# EAGLE design GoL 1.3 (EAGLE 4.13)
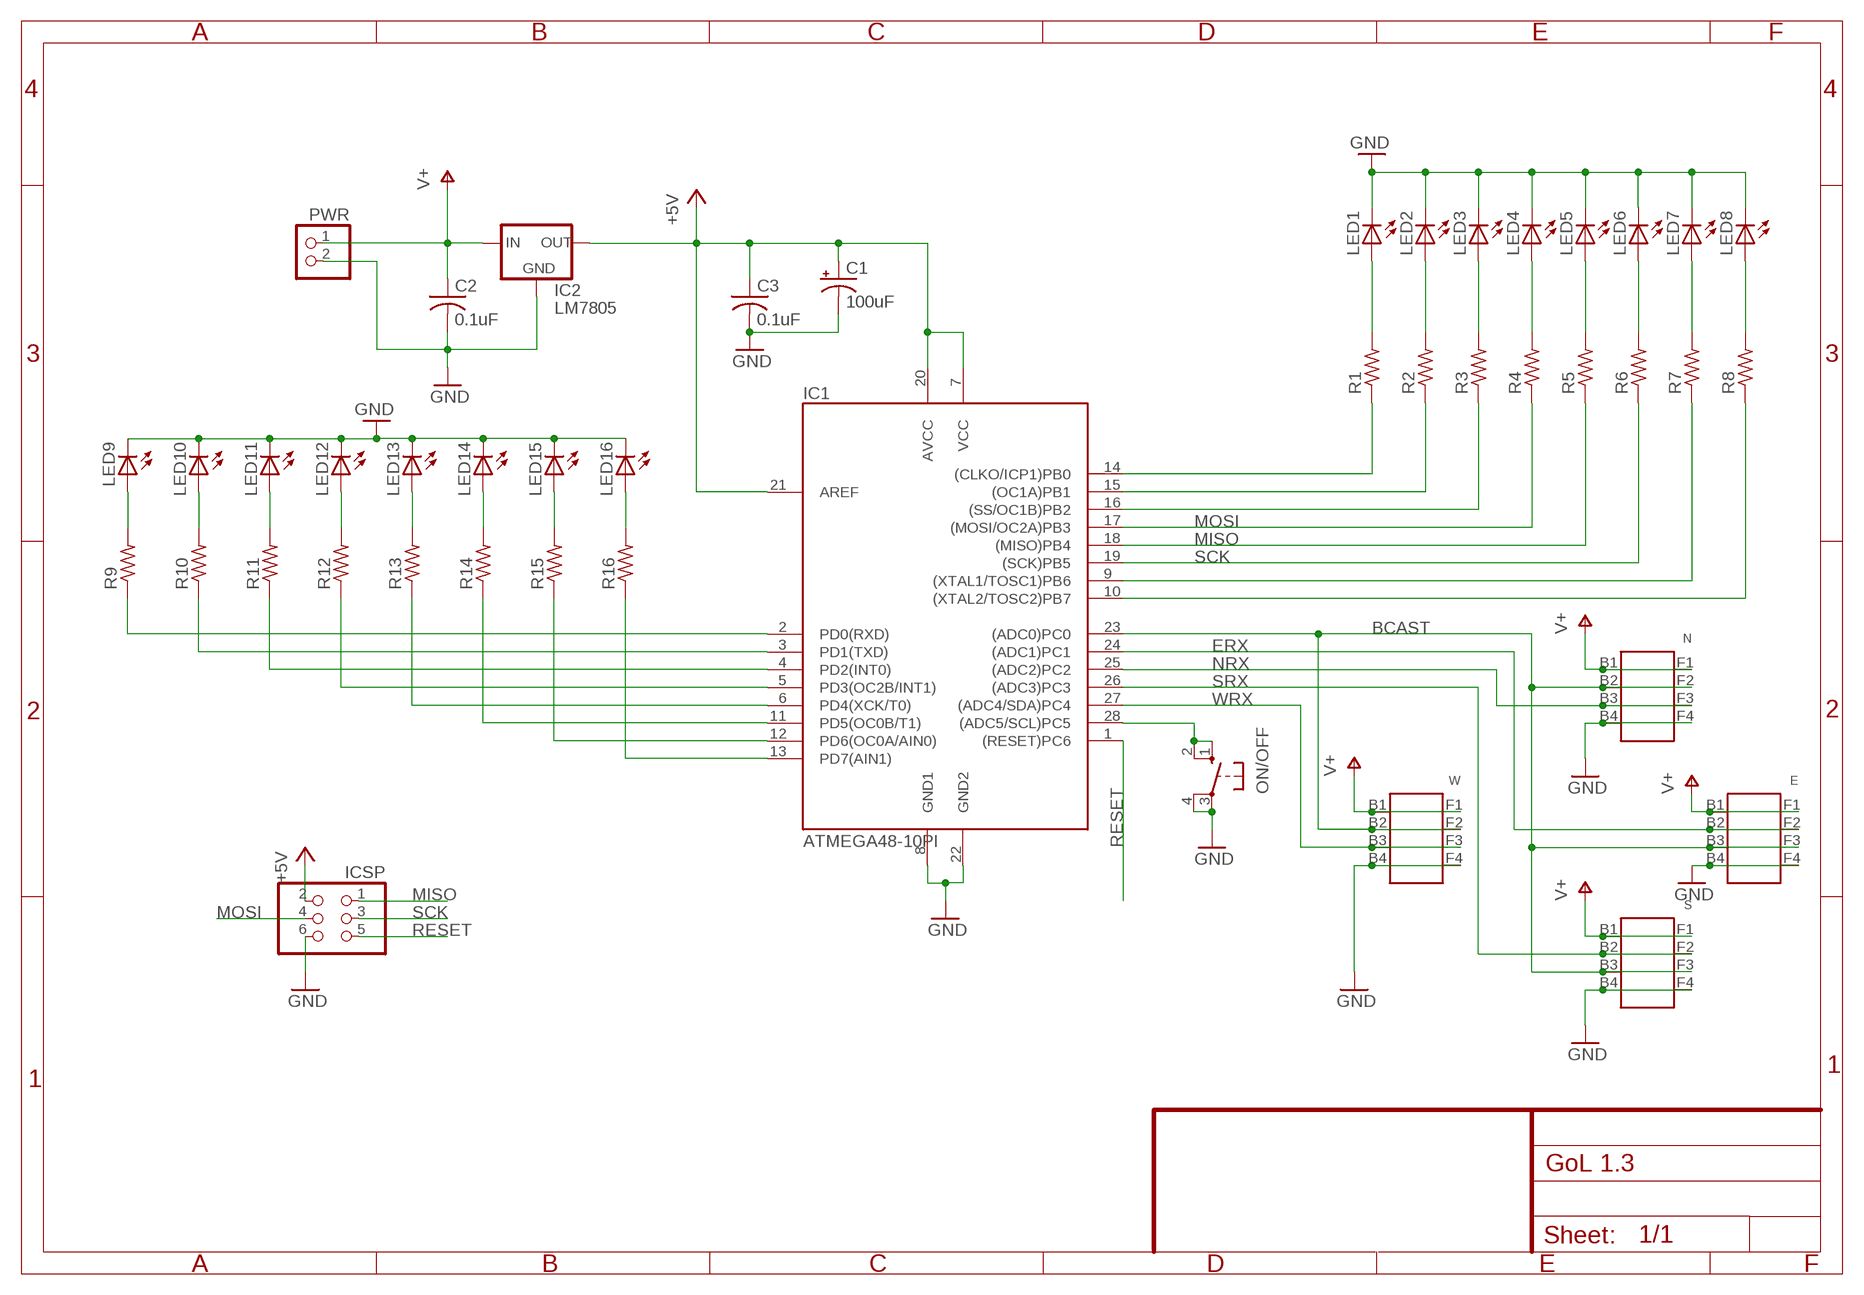
[diagram p0: schematic, sheet 1]

## Parts
C1  100uF  CPOL-USE2.5-6  [E2,5-6]
C2  0.1uF  C-US025-025X050  [C025-025X050]
C3  0.1uF  C-US025-025X050  [C025-025X050]
E  CONNECT4  [CON4-0.15]
IC1  ATMEGA48-10PI  [DIL28-3]
IC2  LM7805  [TO220]
ICSP  PINHD-2X3  [2X03]
LED1  LED5MMEZ  [LED5MM-EZ]
LED2  LED5MMEZ  [LED5MM-EZ]
LED3  LED5MMEZ  [LED5MM-EZ]
LED4  LED5MMEZ  [LED5MM-EZ]
LED5  LED5MMEZ  [LED5MM-EZ]
LED6  LED5MMEZ  [LED5MM-EZ]
LED7  LED5MMEZ  [LED5MM-EZ]
LED8  LED5MMEZ  [LED5MM-EZ]
LED9  LED5MMEZ  [LED5MM-EZ]
LED10  LED5MMEZ  [LED5MM-EZ]
LED11  LED5MMEZ  [LED5MM-EZ]
LED12  LED5MMEZ  [LED5MM-EZ]
LED13  LED5MMEZ  [LED5MM-EZ]
LED14  LED5MMEZ  [LED5MM-EZ]
LED15  LED5MMEZ  [LED5MM-EZ]
LED16  LED5MMEZ  [LED5MM-EZ]
N  CONNECT4  [CON4-0.15]
ON/OFF  10-XX  [B3F-10XX]
PWR  PINHD-1X2  [1X02]
R1  R-US_0207/10  [0207/10]
R2  R-US_0207/10  [0207/10]
R3  R-US_0207/10  [0207/10]
R4  R-US_0207/10  [0207/10]
R5  R-US_0207/10  [0207/10]
R6  R-US_0207/10  [0207/10]
R7  R-US_0207/10  [0207/10]
R8  R-US_0207/10  [0207/10]
R9  R-US_0207/10  [0207/10]
R10  R-US_0207/10  [0207/10]
R11  R-US_0207/10  [0207/10]
R12  R-US_0207/10  [0207/10]
R13  R-US_0207/10  [0207/10]
R14  R-US_0207/10  [0207/10]
R15  R-US_0207/10  [0207/10]
R16  R-US_0207/10  [0207/10]
S  CONNECT4  [CON4-0.15]
W  CONNECT4  [CON4-0.15]

## Nets
+5V [power]: C1.+ C3.1 IC1.7(VCC) IC1.20(AVCC) IC1.21(AREF) IC2.3(OUT) ICSP.2
BCAST: E.B3 E.F3 IC1.23((ADC0)PC0) N.B2 N.F2 S.B3 S.F3 W.B2 W.F2
ERX: E.B2 E.F2 IC1.24((ADC1)PC1)
GND [power]: C1.- C2.2 C3.2 E.B4 E.F4 IC1.8(GND1) IC1.22(GND2) IC2.2(GND) ICSP.6 LED1.K(C) LED2.K(C) LED3.K(C) LED4.K(C) LED5.K(C) LED6.K(C) LED7.K(C) LED8.K(C) LED9.K(C) LED10.K(C) LED11.K(C) LED12.K(C) LED13.K(C) LED14.K(C) LED15.K(C) LED16.K(C) N.B4 N.F4 ON/OFF.3(P) ON/OFF.4(P1) PWR.2 S.B4 S.F4 W.B4 W.F4
MISO: IC1.18((MISO)PB4) ICSP.1 R5.1
MOSI: IC1.17((MOSI/OC2A)PB3) ICSP.4 R4.1
N$1: LED1.A R1.2
N$2: LED2.A R2.2
N$3: LED3.A R3.2
N$4: LED4.A R4.2
N$5: LED5.A R5.2
N$6: LED6.A R6.2
N$7: LED7.A R7.2
N$8: LED8.A R8.2
N$9: LED9.A R9.2
N$10: LED10.A R10.2
N$11: LED11.A R11.2
N$12: LED12.A R12.2
N$13: LED13.A R13.2
N$14: LED14.A R14.2
N$15: LED15.A R15.2
N$16: LED16.A R16.2
N$17: IC1.13(PD7(AIN1)) R16.1
N$18: IC1.12(PD6(OC0A/AIN0)) R15.1
N$19: IC1.11(PD5(OC0B/T1)) R14.1
N$20: IC1.6(PD4(XCK/T0)) R13.1
N$21: IC1.5(PD3(OC2B/INT1)) R12.1
N$22: IC1.4(PD2(INT0)) R11.1
N$23: IC1.3(PD1(TXD)) R10.1
N$24: IC1.2(PD0(RXD)) R9.1
N$25: IC1.28((ADC5/SCL)PC5) ON/OFF.1(S) ON/OFF.2(S1)
N$26: IC1.14((CLKO/ICP1)PB0) R1.1
N$27: IC1.15((OC1A)PB1) R2.1
N$28: IC1.16((SS/OC1B)PB2) R3.1
N$32: IC1.9((XTAL1/TOSC1)PB6) R7.1
N$33: IC1.10((XTAL2/TOSC2)PB7) R8.1
NRX: IC1.25((ADC2)PC2) N.B3 N.F3
RESET: IC1.1((RESET)PC6) ICSP.5
SCK: IC1.19((SCK)PB5) ICSP.3 R6.1
SRX: IC1.26((ADC3)PC3) S.B2 S.F2
V+ [power]: C2.1 E.B1 E.F1 IC2.1(IN) N.B1 N.F1 PWR.1 S.B1 S.F1 W.B1 W.F1
WRX: IC1.27((ADC4/SDA)PC4) W.B3 W.F3

## Library data of the parts
C1 = rcl-ez:CPOL-US: POLARIZED CAPACITOR, American symbol
C2 C3 = rcl-ez:C-US: CAPACITOR, American symbol
E N S W = lifeofrush:CONNECT4
IC1 = atmel-2005:ATMEGA*PI: MICROCONTROLLER 8KB Flash 10-bit ADC Six PWM Channels
IC2 = lifeofrush:LM7805: LM7805 5V Linear Regulator
ICSP = pinhead:PINHD-2X3: PIN HEADER
LED1-LED16 = led:LED: LED OSRAM: - CHIPLED LG R971, LG N971, LY N971, LG Q971, LY Q971, LO R971, LY R971 LH N974, LH R974 LS Q976, LO Q976, LY Q976 LO Q996 - Hyper CHIPLED LW Q18S LB Q993, LB Q99A, LB R99A - SideLED LS A670, LO A670, LY A670, LG A670, LP A670 LB A673, LV A673, LT A673, LW A673 LH A674 LY A675 LS A676, LA A676, LO A676, LY A676, LW A676 LS A679, LY A679, LG A679 - Hyper Micro SIDELED® LS Y876, LA Y876, LO Y876, LY Y876 LT Y87S - SmartLED LW L88C, LW L88S LB L89C, LB L89S, LG L890 LS L89K, LO L89K, LY L89K LS L896, LA L896, LO L896, LY L896 - TOPLED LS T670, LO T670, LY T670, LG T670, LP T670 LSG T670, LSP T670, LSY T670, LOP T670, LYG T670 LG T671, LOG T671, LSG T671 LB T673, LV T673, LT T673, LW T673 LH T674 LS T676, LA T676, LO T676, LY T676, LB T676, LH T676, LSB T676, LW T676 LB T67C, LV T67C, LT T67C, LS T67K, LO T67K, LY T67K, LW E67C LS E67B, LA E67B, LO E67B, LY E67B, LB E67C, LV E67C, LT E67C LW T67C LS T679, LY T679, LG T679 LS T770, LO T770, LY T770, LG T770, LP T770 LB T773, LV T773, LT T773, LW T773 LH T774 LS E675, LA E675, LY E675, LS T675 LS T776, LA T776, LO T776, LY T776, LB T776 LHGB T686 LT T68C, LB T68C - Hyper Mini TOPLED® LB M676 - Mini TOPLED Santana® LG M470 LS M47K, LO M47K, LY M47K Source: http://www.osram.convergy.de/
ON/OFF = switch-omron:10-XX: OMRON SWITCH
PWR = pinhead:PINHD-1X2: PIN HEADER
R1-R16 = rcl-ez:R-US_: RESISTOR, American symbol

## Net classes
1 power: width 1.27 mm, drill 0.406 mm, clearance 0.711 mm

## Board
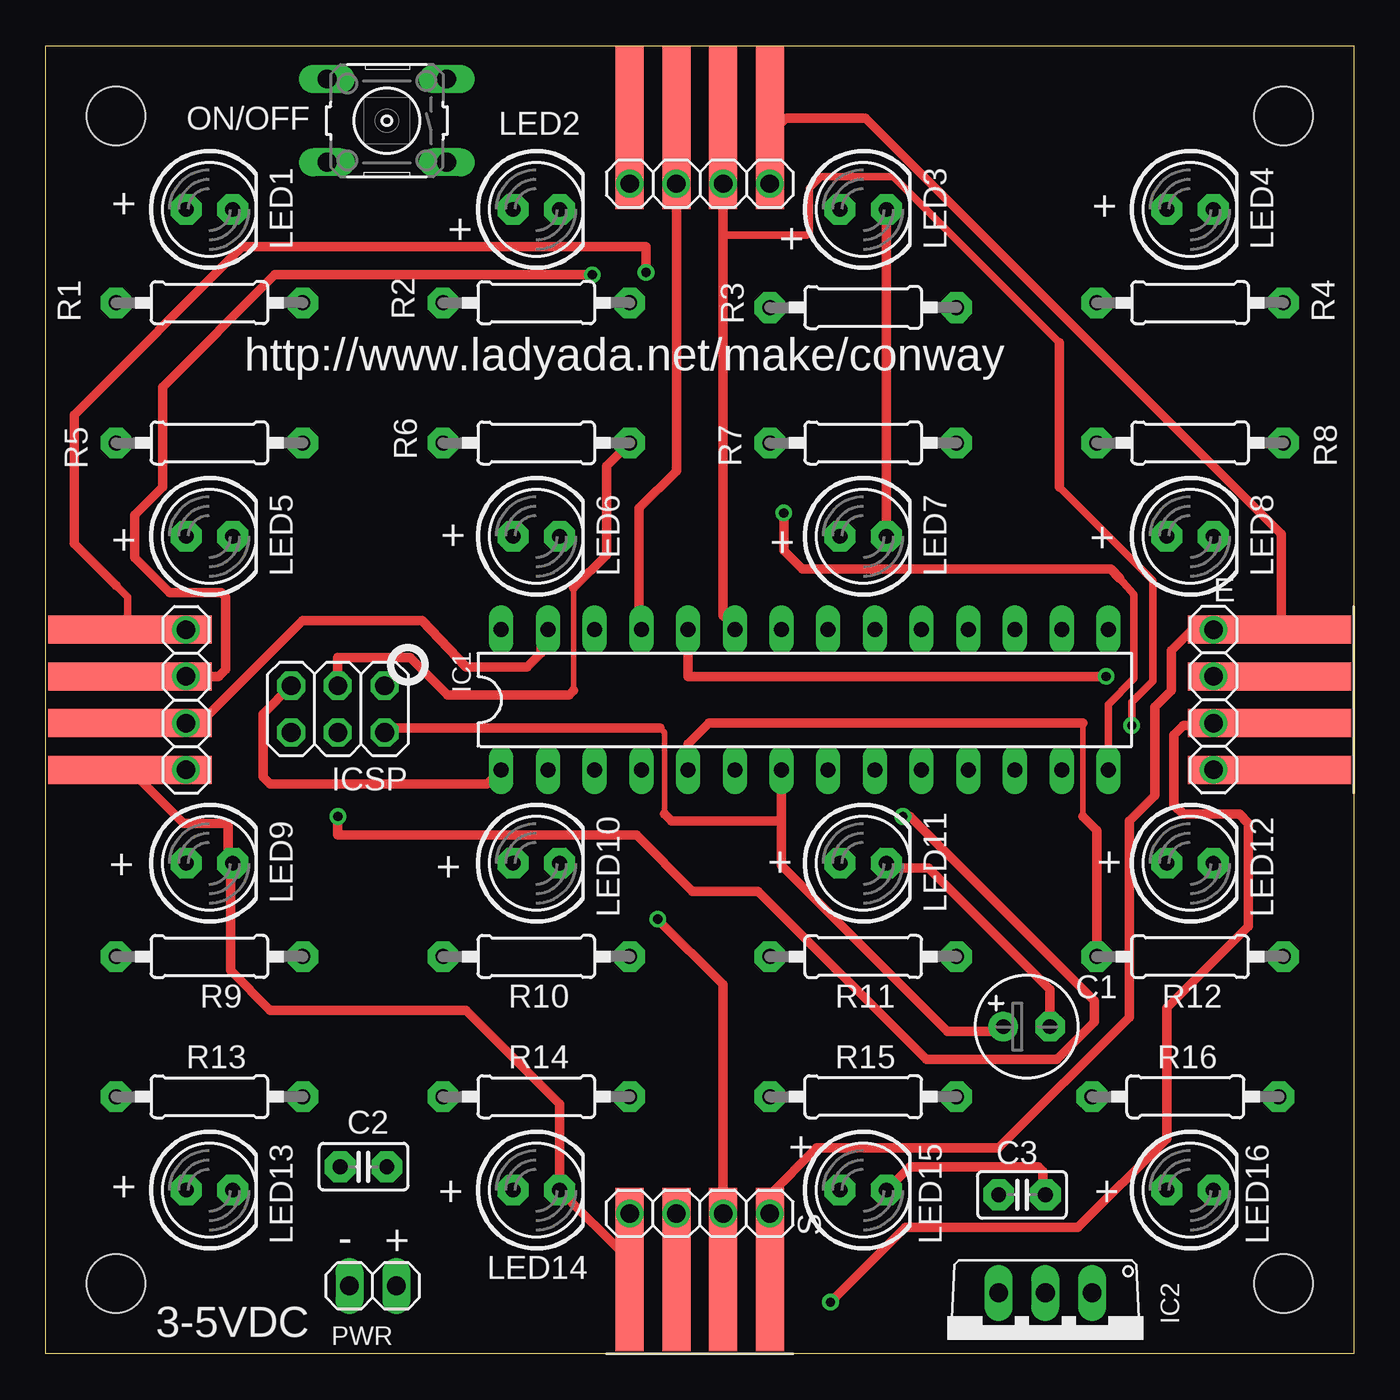
[diagram p1: board, top side]
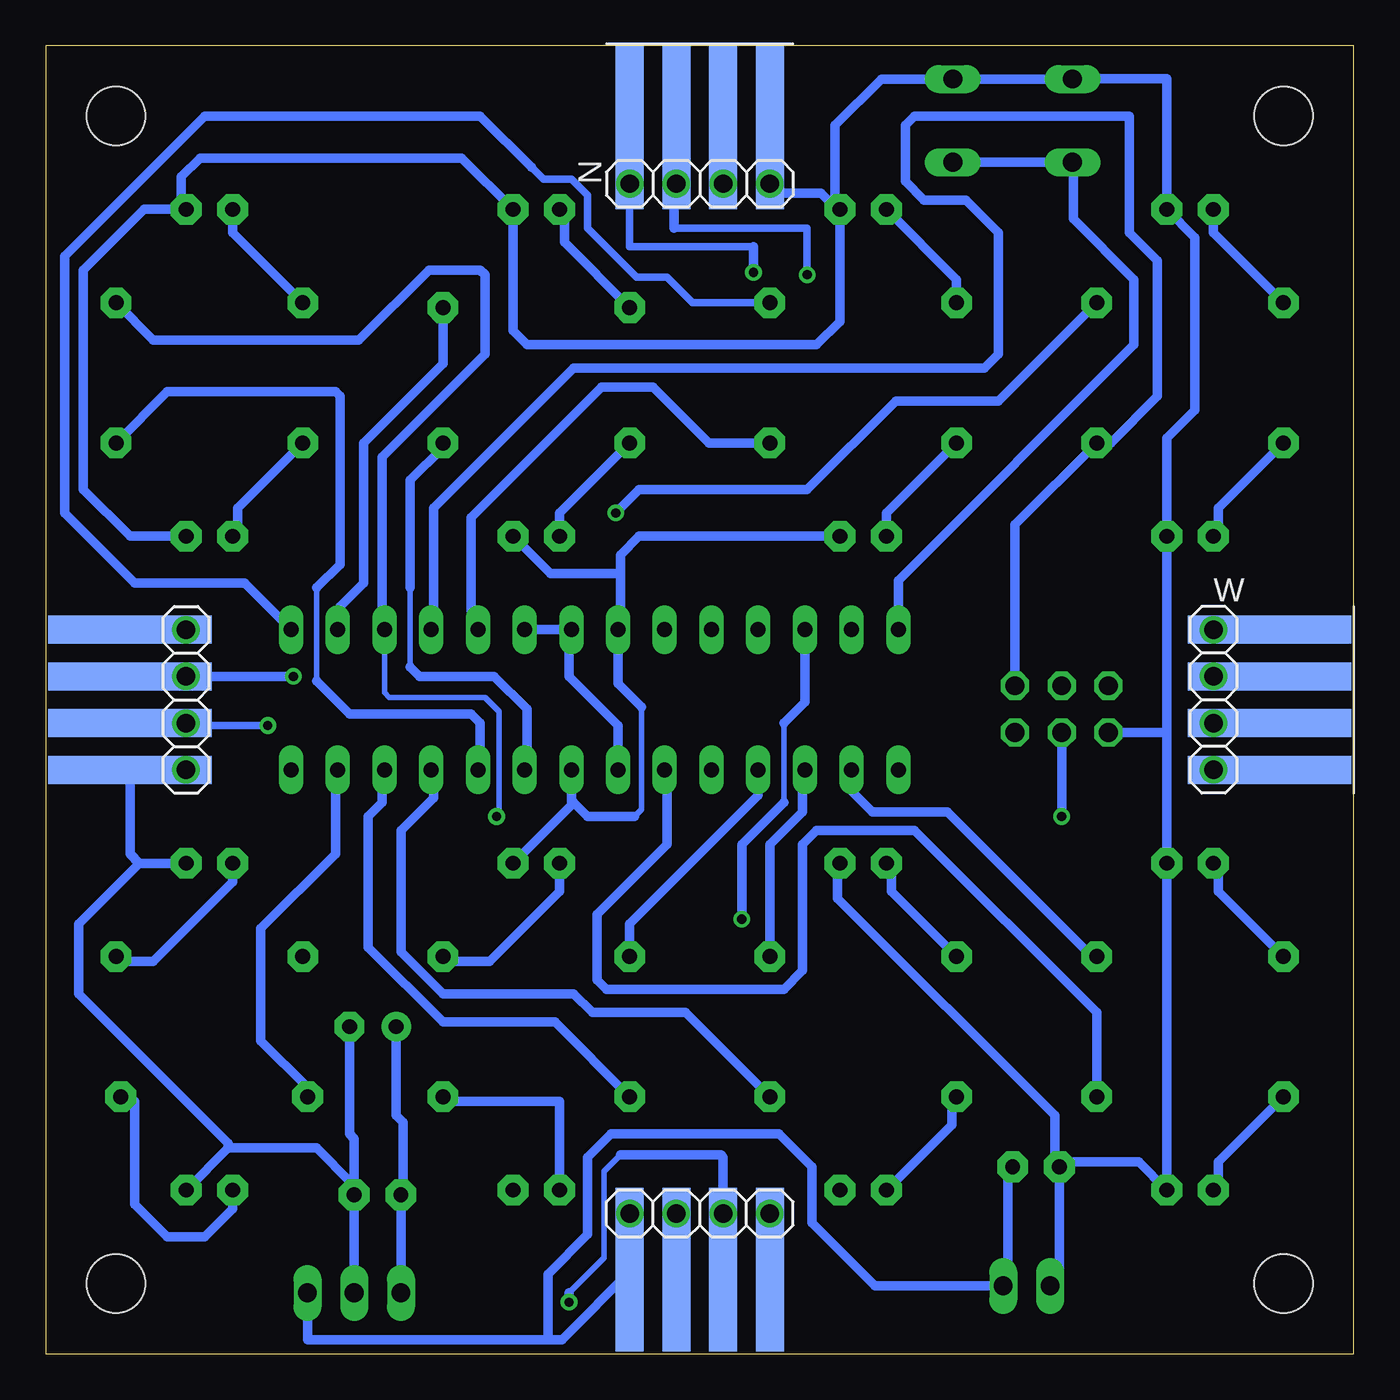
[diagram p2: board, bottom side, seen from below]

Size 71.12 x 71.12 mm. Coordinates in mm from the lower left corner, seen from the top.
Outline: 0,0 0,71.12 71.12,71.12 71.12,0 0,0
Copper layers (1*16): Top 0.035mm / dielectric 1.5mm / Bottom 0.035mm
Design rules "default": minimum track width 2mil, minimum drill 19mil, track to track 12mil, track to pad 12mil, pad to pad 12mil, via to via 12mil, smd to smd 0mil, copper to edge 0mil, drill to drill 8mil, minimum pad ring 10mil, minimum via ring 8mil, stop-mask expansion 4mil, vias tented up to drill 0mil, thermal gap 10mil
Holes 3.2 mm at 3.81,67.31 67.31,67.31 67.31,3.81 3.81,3.81

### Footprints (pad centres in the part's own frame; a part is rotated, then mirrored left to right if it is on the bottom)
E2,5-6 = drill 0.813 pad 1.6 round: + -1.27,0 | drill 0.813 pad 1.6 octagon: - 1.27,0
C025-025X050 = drill 0.813 pad 1.676 octagon: 1 -1.27,0; 2 1.27,0
CON4-0.15 = smd 1.524 x 8.89 bottom: B1 -3.81,3.048; B2 -1.27,3.048; B3 1.27,3.048; B4 3.81,3.048 | smd 1.524 x 8.89: F1 -3.81,3.048; F2 -1.27,3.048; F3 1.27,3.048; F4 3.81,3.048
DIL28-3 = drill 0.813 long: 1 -16.51,-3.81; 2 -13.97,-3.81; 3 -11.43,-3.81; 4 -8.89,-3.81; 5 -6.35,-3.81; 6 -3.81,-3.81; 7 -1.27,-3.81; 8 1.27,-3.81; 9 3.81,-3.81; 10 6.35,-3.81; 11 8.89,-3.81; 12 11.43,-3.81; 13 13.97,-3.81; 14 16.51,-3.81; 15 16.51,3.81; 16 13.97,3.81; 17 11.43,3.81; 18 8.89,3.81; 19 6.35,3.81; 20 3.81,3.81; 21 1.27,3.81; 22 -1.27,3.81; 23 -3.81,3.81; 24 -6.35,3.81; 25 -8.89,3.81; 26 -11.43,3.81; 27 -13.97,3.81; 28 -16.51,3.81
TO220@1 = drill 1.016 long: 1 -2.54,-2.54; 2 0,-2.54; 3 2.54,-2.54
2X03 = drill 1.016 octagon: 1 -2.54,-1.27; 2 -2.54,1.27; 3 0,-1.27; 4 0,1.27; 5 2.54,-1.27; 6 2.54,1.27
LED5MM-EZ = drill 0.813 pad 1.676 octagon: A -1.27,0; K 1.27,0
B3F-10XX = drill 1.016 long: 1 -3.251,2.261; 2 3.251,2.261; 3 -3.251,-2.261; 4 3.251,-2.261
1X02 = drill 1.016 long: 1 -1.27,0; 2 1.27,0
0207/10 = drill 0.813 pad 1.676 octagon: 1 -5.08,0; 2 5.08,0

### Placement (x,y rotation side)
C1  53.34,17.78 0 top
C2  17.27,10.16 180 top
C3  53.09,8.64 0 top
E  63.5,35.56 270 top
IC1  41.27,35.56 0 top
IC2  LM7805  [TO220@1]  54.36,0.76 180 top
ICSP  15.88,35.05 180 top
LED1  8.89,62.23 0 top
LED2  26.67,62.23 0 top
LED3  44.45,62.23 0 top
LED4  62.23,62.23 0 top
LED5  8.89,44.45 0 top
LED6  26.67,44.45 0 top
LED7  44.45,44.45 0 top
LED8  62.23,44.45 0 top
LED9  8.89,26.67 0 top
LED10  26.67,26.67 0 top
LED11  44.45,26.67 0 top
LED12  62.23,26.67 0 top
LED13  8.89,8.89 0 top
LED14  26.67,8.89 0 top
LED15  44.45,8.89 0 top
LED16  62.23,8.89 0 top
N  35.56,63.63 0 bottom
ON/OFF  18.54,67.06 180 top
PWR  17.78,3.68 180 top
R1  8.89,57.15 180 top
R2  26.67,57.15 180 top
R3  44.45,56.9 180 top
R4  62.23,57.15 180 top
R5  8.89,49.53 180 top
R6  26.67,49.53 180 top
R7  44.45,49.53 180 top
R8  62.23,49.53 180 top
R9  8.89,21.59 180 top
R10  26.67,21.59 180 top
R11  44.45,21.59 0 top
R12  62.23,21.59 0 top
R13  8.89,13.97 180 top
R14  26.67,13.97 180 top
R15  44.45,13.97 0 top
R16  61.98,13.97 0 top
S  35.56,7.62 180 top
W  7.62,35.56 270 bottom

### Tracks (layer width: path | path; a pad name or v marks a point on that pad's centre or on a via)
+5V
  Top 0.305: 33.4,34.04 33.66,33.78 33.66,29.34
  Top 0.508: 40.01,28.96 40.01,26.54 49.02,17.53 51.82,17.53 C1.+ | 40.01,28.96 IC1.7 | ICSP.2 18.67,34.04 33.4,34.04 | 33.66,29.34 34.04,28.96 40.01,28.96
  Bottom 0.508: IC1.20 45.09,39.5 44.96,39.62 44.7,39.37 42.67,39.37 | C3.1 51.82,8.89 | C3.1 IC2.3 | IC1.7 40.01,34.16 42.67,36.83 42.67,39.37 | 42.67,39.37 IC1.21 | C1.+ 52.07,12.95 51.69,12.57 51.69,8.64 C3.1
BCAST  (via drill 0.5, 1)
  Top 0.406: 55.12,47.12 60.2,42.04 60.2,36.58 59.05,35.43 v59.05,34.16 | 55.12,54.99 46.1,64.01 42.16,64.01 41.53,63.37 41.53,60.96 41.4,60.83 36.83,60.83
  Top 0.508: IC1.23 37.59,39.5 | v29.72,58.67 12.45,58.67 6.35,52.58 6.35,47.12 4.83,45.59 4.83,43.31 6.73,41.4 9.53,41.4 9.78,41.15 9.78,37.21 9.4,36.83 v7.62,36.83 | IC1.23 37.59,39.37 | v42.67,2.79 46.74,6.86 56.13,6.86 60.96,11.68 60.96,18.8 65.41,23.24 65.41,28.83 64.9,29.34 61.85,29.34 61.34,29.84 61.34,33.66 61.85,34.16 66.67,34.16 E.B3 v63.5,34.29 | IC1.23 37.47,39.5 36.83,40.13 36.83,60.83 N.B2 | N.B2 36.83,67.06 | 55.12,47.12 55.12,54.99 | W.B2 4.45,36.83 | v7.62,36.83 W.B2 | W.B2 4.57,36.96 | 4.57,36.96 6.6,36.96 | 4.57,36.96 2.03,36.96 v7.62,36.83 | N.B2 v36.83,63.63 36.83,62.87 | v34.29,7.62 S.B3
  Bottom 0.305: 42.67,3.3 40.77,5.21 40.77,9.91 39.88,10.79
  Bottom 0.406: E.B3 66.42,34.16 v59.05,34.16 | v29.72,58.67 29.72,61.21 36.96,61.21 36.96,66.04 36.83,66.04
  Bottom 0.508: 42.67,3.3 v42.67,2.79 | 39.88,10.79 34.42,10.79 34.29,10.67 S.B3 v34.29,7.62 34.29,9.14 | N.B2 v36.83,63.63 36.7,63.63 36.96,63.37 36.96,61.21 | E.B3 66.55,34.16 65.15,34.29 v63.5,34.29 | v7.62,36.83 W.B2 3.3,36.96 v7.62,36.83
ERX  (via drill 0.5, 1)
  Top 0.508: IC1.24 34.92,36.83 v57.66,36.83 | v63.5,36.83 E.B2
  Bottom 0.508: v57.66,36.83 E.B2 65.28,36.7 v63.5,36.83
GND  (via drill 1)
  Top 0.508: C1.- 54.61,19.81 48.01,26.42 45.97,26.42 LED11.K | LED3.K LED7.K | LED14.K 27.69,8.64 | LED14.K 27.94,13.59 22.86,18.67 12.19,18.67 10.03,20.83 10.03,26.54 LED9.K 10.16,26.92 9.91,27.18 9.91,28.7 9.78,28.83 7.49,28.83 W.B4 v7.62,31.75 7.87,31.62 | LED14.K 31.62,5.21 31.62,4.45 S.B4 v31.75,7.62 | v31.75,63.63 N.B4 | E.B4 66.42,31.75 66.29,31.88 65.15,31.75 v63.5,31.75 | LED15.K 46.99,10.16 53.98,10.16 54.23,9.91 54.23,8.76 C3.2
  Bottom 0.305: 38.73,35.18 38.73,29.59 39.12,29.21
  Bottom 0.406: C2.2 15.75,10.16 16,9.91 16,9.65
  Bottom 0.508: LED8.K 66.55,44.45 69.09,46.99 69.09,58.93 65.79,62.23 LED4.K 63.75,62.23 63.75,64.01 62.74,65.02 48.51,65.02 LED3.K 45.72,55.63 44.96,54.86 29.21,54.86 27.94,56.13 LED2.K | 61.21,11.18 LED16.K | 61.21,11.18 56.39,11.18 54.48,9.27 | C1.- 54.61,11.94 54.36,11.68 54.36,9.4 54.48,9.27 | LED14.K 27.94,9.14 | 64.52,26.67 LED12.K 66.04,26.67 | 66.04,26.67 69.34,23.37 69.34,19.56 61.21,11.43 61.21,11.18 | LED6.K 38.86,44.45 39.88,43.43 39.88,42.42 | 39.88,42.42 39.88,39.5 IC1.22 40.01,36.45 38.73,35.18 | LED7.K 43.69,42.42 39.88,42.42 | ON/OFF.3 ON/OFF.4 15.47,69.32 15.49,69.34 10.16,69.34 LED1.K 8.64,60.71 8.64,51.31 10.16,49.78 LED5.K | ON/OFF.3 21.82,69.32 21.84,69.34 | ON/OFF.3 25.68,69.32 28.19,66.8 28.19,62.48 LED2.K | LED5.K 9.91,44.45 | 10.16,33.78 10.16,27.43 10.41,27.18 10.41,26.92 LED9.K LED13.K 11.68,10.41 16.26,10.41 | 10.16,33.78 LED5.K | 10.16,33.78 ICSP.6 | IC2.2 54.61,3.56 54.36,3.81 C3.2 54.36,9.14 54.48,9.27 | 16.26,10.16 16.26,9.91 C2.2 16.26,10.16 | 16.26,10.41 16.26,12.95 28.07,24.77 28.07,26.54 LED10.K | 16,9.65 16,3.56 16.26,3.81 16.38,3.81 PWR.2 | 16.26,10.41 16.26,10.16 | 42.55,29.97 42.55,29.84 LED11.K | 42.55,29.97 IC1.8 | 42.55,29.97 42.42,29.97 41.66,29.21 39.12,29.21 | 66.04,26.67 66.55,27.18 E.B4 v63.5,31.75 | v7.62,31.75 4.7,31.88 W.B4 | v31.75,63.63 N.B4 v31.75,63.63 | v31.75,63.63 31.24,63.12 28.96,63.12 28.07,62.23 LED2.K | v31.75,7.62 S.B4
MISO
  Bottom 0.508: ICSP.1 18.41,45.09 R5.1 13.21,49.53 10.67,52.07 10.67,59.44 12.19,60.96 12.19,67.31 23.88,67.31 24.38,66.8 24.38,63.75 23.37,62.74 21.08,62.74 19.3,60.96 19.3,54.36 20.07,53.59 42.42,53.59 50.04,45.97 50.04,39.5 IC1.18
MOSI  (via drill 0.5)
  Top 0.508: v15.88,29.21 15.88,28.19 32.13,28.19 35.18,25.15 38.73,25.15 47.88,16 54.99,16 57.02,18.03 57.02,19.18 46.99,29.21 v46.61,29.21
  Bottom 0.305: v46.61,29.21 46.48,29.34 46.48,34.92 47.24,35.69 52.45,35.69 52.7,35.94 IC1.17 52.7,39.75
  Bottom 0.508: R4.1 65.28,55.12 54.1,55.12 50.29,58.93 47.5,58.93 47.24,58.67 47.24,54.36 52.83,48.77 52.83,39.5 IC1.17 | v15.88,29.21 ICSP.4
N$1
  Bottom 0.508: 7.62,62.48 LED1.A 7.62,60.96 R1.2
N$2
  Bottom 0.508: LED2.A 21.59,58.42 R2.2
N$3
  Bottom 0.508: LED3.A 42.93,62.23 42.93,60.45 R3.2
N$4
  Bottom 0.508: R4.2 60.96,60.96 LED4.A
N$5
  Bottom 0.508: R5.2 7.37,45.97 7.37,44.45 LED5.A
N$6
  Bottom 0.508: R6.2 25.4,45.72 LED6.A
N$7
  Bottom 0.508: R7.2 43.18,45.72 LED7.A
N$8
  Bottom 0.508: LED8.A 60.71,44.45 60.71,45.97 R8.2
N$9
  Bottom 0.508: LED9.A 7.37,26.42 7.37,25.15 R9.2
N$10
  Bottom 0.508: LED10.A 25.15,26.67 25.15,25.15 R10.2
N$11
  Bottom 0.508: LED11.A 43.18,25.15 46.99,21.34 49.28,21.34 R11.2
N$12
  Bottom 0.508: LED12.A 60.96,25.65 65.28,21.34 66.8,21.34 67.31,21.84 R12.2
N$13
  Bottom 0.508: R13.2 7.37,10.41 7.37,9.14 LED13.A
N$14
  Bottom 0.508: R14.2 21.84,13.97 21.84,12.45 LED14.A
N$15
  Bottom 0.508: R15.2 49.53,13.72 43.18,13.72 LED15.A
N$16
  Bottom 0.508: LED16.A 60.96,7.87 62.48,6.35 64.52,6.35 66.29,8.13 66.29,13.72 66.8,14.22 R16.2
N$17
  Bottom 0.508: R16.1 56.9,14.48 59.44,17.02 59.44,23.11 55.37,27.18 55.37,30.99 55.12,31.24 55.12,31.75 IC1.13
N$18
  Bottom 0.508: R15.1 43.43,18.03 49.53,18.03 53.59,22.1 53.59,29.21 52.83,29.97 52.83,31.75 IC1.12
N$19
  Bottom 0.508: R14.1 36.32,18.54 41.4,18.54 42.42,19.56 49.53,19.56 51.82,21.84 51.82,28.45 50.04,30.23 50.04,31.75 IC1.11
N$20
  Bottom 0.508: R13.1 13.97,18.54 23.88,28.45 29.21,28.45 29.97,27.69 29.97,20.83 30.99,19.81 40.64,19.81 41.15,20.32 41.15,23.88 37.34,27.69 37.34,32 37.47,31.88 IC1.6
N$21
  Top 0.305: 56.39,34.29 56.39,29.21
  Top 0.508: IC1.5 34.92,33.15 36.07,34.29 56.39,34.29 | 56.39,29.21 57.15,28.45 R12.1
N$22
  Bottom 0.508: IC1.4 32.38,30.35 39.37,23.37 R11.1
N$23
  Bottom 0.508: R10.1 31.75,27.69 29.97,29.46 29.97,31.75 IC1.3
N$24
  Bottom 0.508: R9.1 14.22,21.59 22.1,29.46 26.16,29.46 27.43,30.73 27.43,31.5 27.18,31.75 IC1.2
N$25
  Bottom 0.508: 21.82,64.8 ON/OFF.1 | ON/OFF.2 21.82,64.8 | 21.82,64.8 21.84,64.77 | IC1.28 24.77,42.04 11.94,54.86 11.94,58.42 15.24,61.72 15.24,64.77 | 15.24,64.77 15.27,64.8 ON/OFF.2 | 15.24,64.77 15.27,64.77 ON/OFF.2
N$26  (via drill 0.5)
  Top 0.406: IC1.14 57.91,31.75 57.78,31.88 57.78,35.31 59.18,36.7 59.18,41.27 58.42,42.16
  Top 0.508: v40.13,45.72 40.13,43.69 41.15,42.67 57.91,42.67 58.42,42.16
  Bottom 0.508: R1.1 19.3,51.82 24.89,51.82 29.72,46.99 38.86,46.99 v40.13,45.72
N$27
  Bottom 0.406: 44.7,64.52 44.07,63.88 42.55,63.88 41.66,62.99 41.66,61.21 38.99,58.55 37.34,58.55 35.94,57.15 R2.1
  Bottom 0.508: 44.7,64.52 47.5,67.31 62.48,67.31 70.1,59.69 70.1,45.72 66.29,41.91 60.33,41.91 IC1.15 57.78,39.24
N$28
  Bottom 0.508: 49.53,57.4 R3.1 49.53,53.85 53.85,49.53 53.85,41.91 55.12,40.64 55.12,39.37 IC1.16
N$32
  Bottom 0.305: 51.31,37.34 51.31,41.66
  Bottom 0.508: R7.1 49.53,49.28 51.31,47.5 51.31,41.66 | 51.31,37.34 50.8,36.83 46.74,36.83 44.96,35.05 44.96,31.88 IC1.9
N$33
  Bottom 0.305: 56.39,36.58 56.39,41.66
  Bottom 0.508: R8.1 64.52,52.32 55.37,52.32 55.12,52.07 55.12,42.93 56.39,41.66 | 56.39,36.58 54.61,34.8 48.01,34.8 47.5,34.29 47.5,31.75 IC1.10
NRX  (via drill 1)
  Top 0.508: 32.26,39.24 32.26,39.12 | IC1.25 32.26,39.24 | 32.26,39.24 32.26,45.97 34.29,48.01 34.29,66.29 34.54,66.55 34.42,66.67 N.B3 34.16,66.55 v34.29,63.63
  Bottom 0.508: v34.29,63.63 N.B3
RESET
  Top 0.508: IC1.1 24,30.99 12.19,30.99 11.81,31.37 11.81,34.8 ICSP.5
SCK
  Top 0.305: 28.7,36.07 28.7,41.66
  Top 0.508: R6.1 30.48,48.26 30.48,43.43 28.7,41.66 | 28.7,36.07 28.45,35.81 21.84,35.81 19.81,37.85 15.88,37.85 ICSP.3
  Bottom 0.508: R6.1 35.05,49.53 38.1,52.58 40.89,52.58 48.01,45.47 48.01,40.39 47.5,39.88 47.5,39.62 47.62,39.5 IC1.19
SRX  (via drill 0.5, 1)
  Top 0.508: v33.27,23.62 36.83,20.07 S.B2 v36.83,7.62 36.83,8.38
  Bottom 0.305: 30.99,29.97 30.99,34.29
  Bottom 0.508: IC1.26 29.84,35.43 30.99,34.29 | 30.99,29.97 33.27,27.69 v33.27,23.62 | 36.83,8.38 v36.83,7.62 S.B2
V+  (via drill 0.5, 1)
  Top 0.406: W.B1 4.45,39.24 4.45,41.15 3.81,41.78
  Top 0.508: 3.81,41.78 1.52,44.07 1.52,51.05 10.67,60.2 32.64,60.2 v32.64,58.8 | S.B1 39.37,4.45 | S.B1 39.37,8.64 41.91,11.18 51.82,11.18 58.93,18.29 58.93,28.96 60.33,30.35 60.33,35.18 61.21,36.07 61.21,38.23 62.36,39.37 v63.5,39.37 E.B1 66.55,39.24 67.06,39.24 67.18,39.12 67.18,44.58 44.58,67.18 40.26,67.18 39.62,66.55 39.5,66.67 N.B1 | W.B1 v7.62,39.37 | N.B1 39.37,66.8 | 39.37,62.74 v39.37,63.63 N.B1 | v39.37,7.62 S.B1
  Bottom 0.406: 32.64,60.2 39.37,60.2 39.37,66.55
  Bottom 0.508: 39.37,66.55 N.B1 v39.37,63.63 39.37,62.74 | IC2.1 56.9,0.76 43.81,0.76 | C2.1 18.8,10.41 18.8,3.94 PWR.1 26.04,3.68 29.46,7.11 29.46,10.16 31.24,11.94 40.39,11.94 41.66,10.67 41.66,6.48 43.81,4.32 43.81,0.76 | 43.81,0.76 43.05,0.76 39.24,4.57 S.B1 38.99,4.95 v39.37,7.62 | v7.62,39.37 W.B1 | v63.5,39.37 E.B1 | 32.64,60.2 v32.64,58.8
WRX  (via drill 1)
  Top 0.508: IC1.27 26.92,39.37 26.92,38.1 26.16,37.34 22.86,37.34 20.45,39.88 13.97,39.88 8.38,34.29 W.B3 v7.62,34.29
  Bottom 0.508: v7.62,34.29 W.B3

### Text on the board
tPlace: + | + | + | + | http://www.ladyada.net/make/conway | + | + | + | + | + | + | + | + | + | + | + | + | - | + | 3-5VDC
tDocu: Game of Life v1.3 | North | orig. by www.dropoutdesign.com | West | East | South